# Altium schematic sheet PB-Block-Diagram.SchDoc
size A4; DrawnBy: UGUR KELES; SheetNumber: 1; SheetTotal: 4; Size: A4
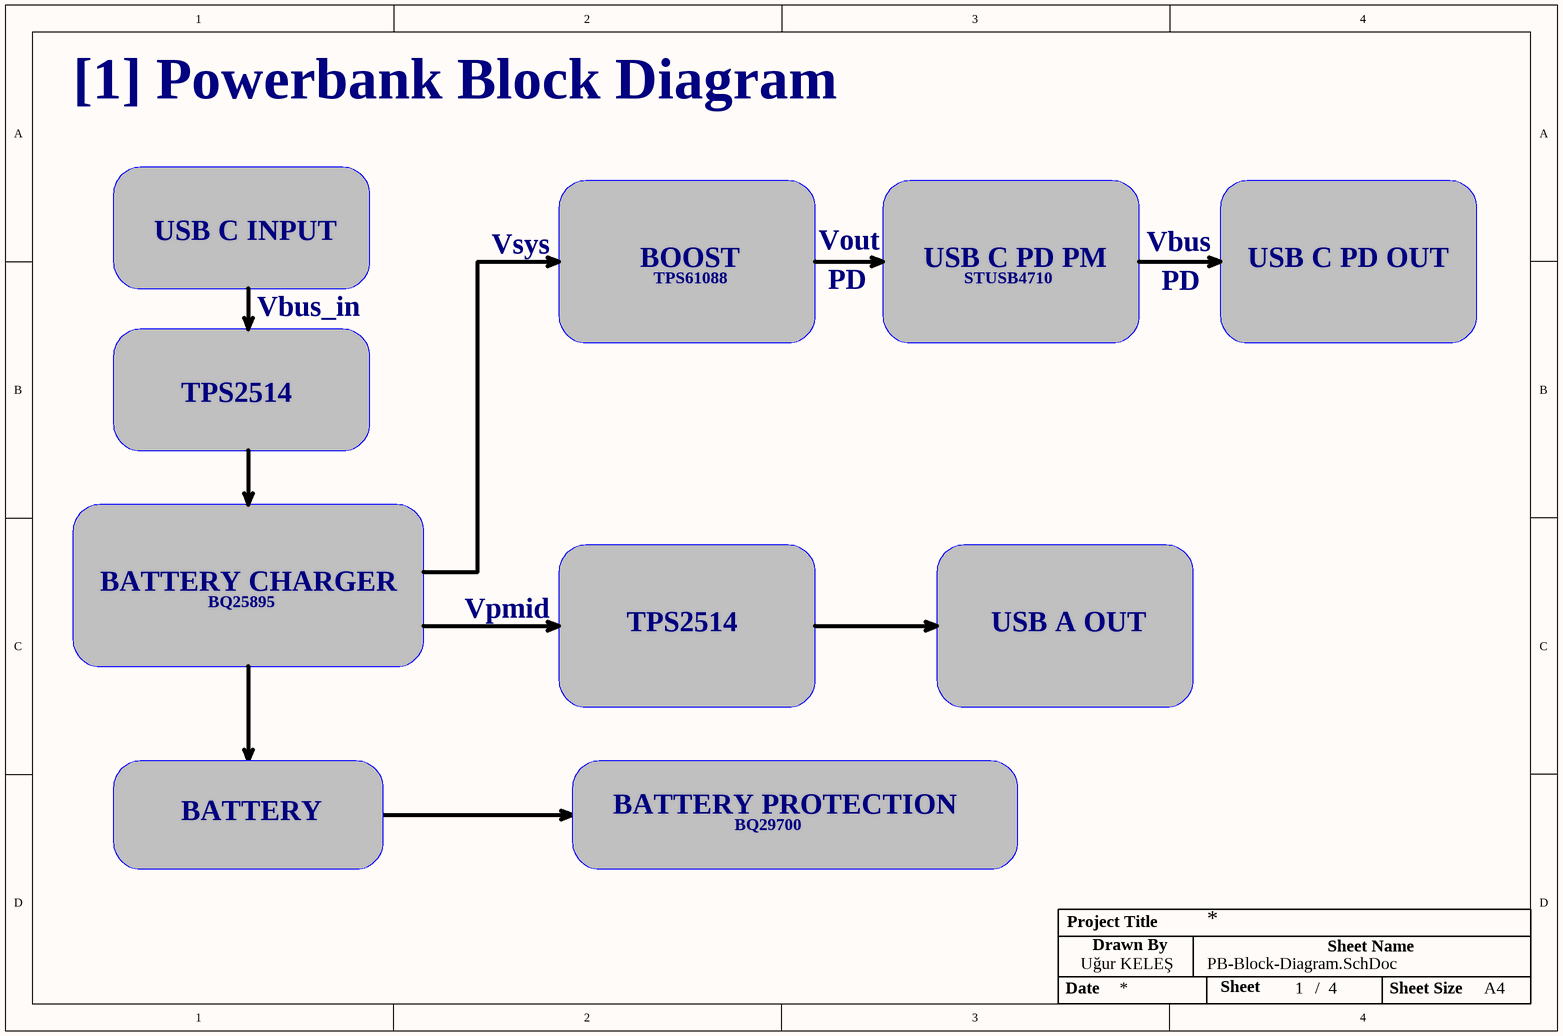
[diagram p0: PB-Block-Diagram.SchDoc]

## Notes on the sheet
- [1] Powerbank Block Diagram
- USB C INPUT
- Vsys
- BOOST
- TPS61088
- Vout
- PD
- USB C PD PM
- STUSB4710
- Vbus
- USB C PD OUT
- Vbus_in
- TPS2514
- BATTERY CHARGER
- BQ25895
- Vpmid
- USB A OUT
- BATTERY
- BATTERY PROTECTION
- BQ29700
- Project Title
- Uğur KELEŞ
- Drawn By
- Sheet Name
- Date
- Sheet
- /
- Sheet Size